# Altium schematic sheet EV_SH.SchDoc
size A4; PageSetup: Record=PageOptions|CenterHorizontal=True|CenterVertical=True|PrintScale=0.97|XCorrection=1.00|YCorrection=1.00|PrintKind=1|BorderSize=5000000|LeftOffset=0|BottomOffset=0|Orientation=2|PaperLength=2970|PaperWidth=2100|Scale=100|PaperSource=4|PrintQuality=600|MediaType=1|DitherType=10|PaperKind=A4|PrintScaleMode=1
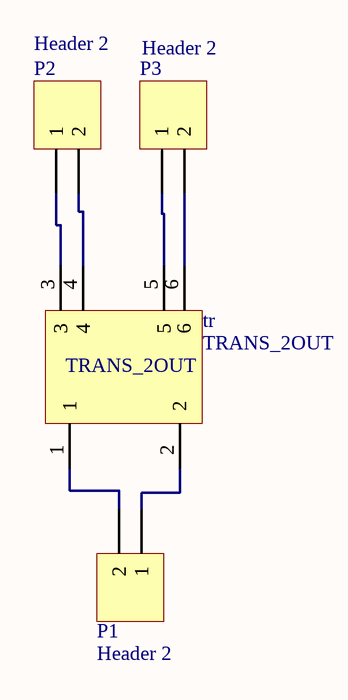
[diagram p0: EV_SH.SchDoc]

## Parts
P1  Header 2  [HDR1X2]
P2  Header 2  [HDR1X2]
P3  Header 2  [HDR1X2]
tr  TRANS_2OUT  [TRANS_2OUT]

## Nets
NetP1_1: P1.1 tr.2
NetP1_2: P1.2 tr.1
NetP2_1: P2.1 tr.3
NetP2_2: P2.2 tr.4
NetP3_1: P3.1 tr.5
NetP3_2: P3.2 tr.6

## Library data of the parts
P1-P3 = Header 2: Header, 2-Pin; LatestRevisionDate: 17-Jul-2002; LatestRevisionNote: Re-released for DXP Platform.; Publisher: Altium Limited